# EAGLE design RoboArm (EAGLE 5.03)
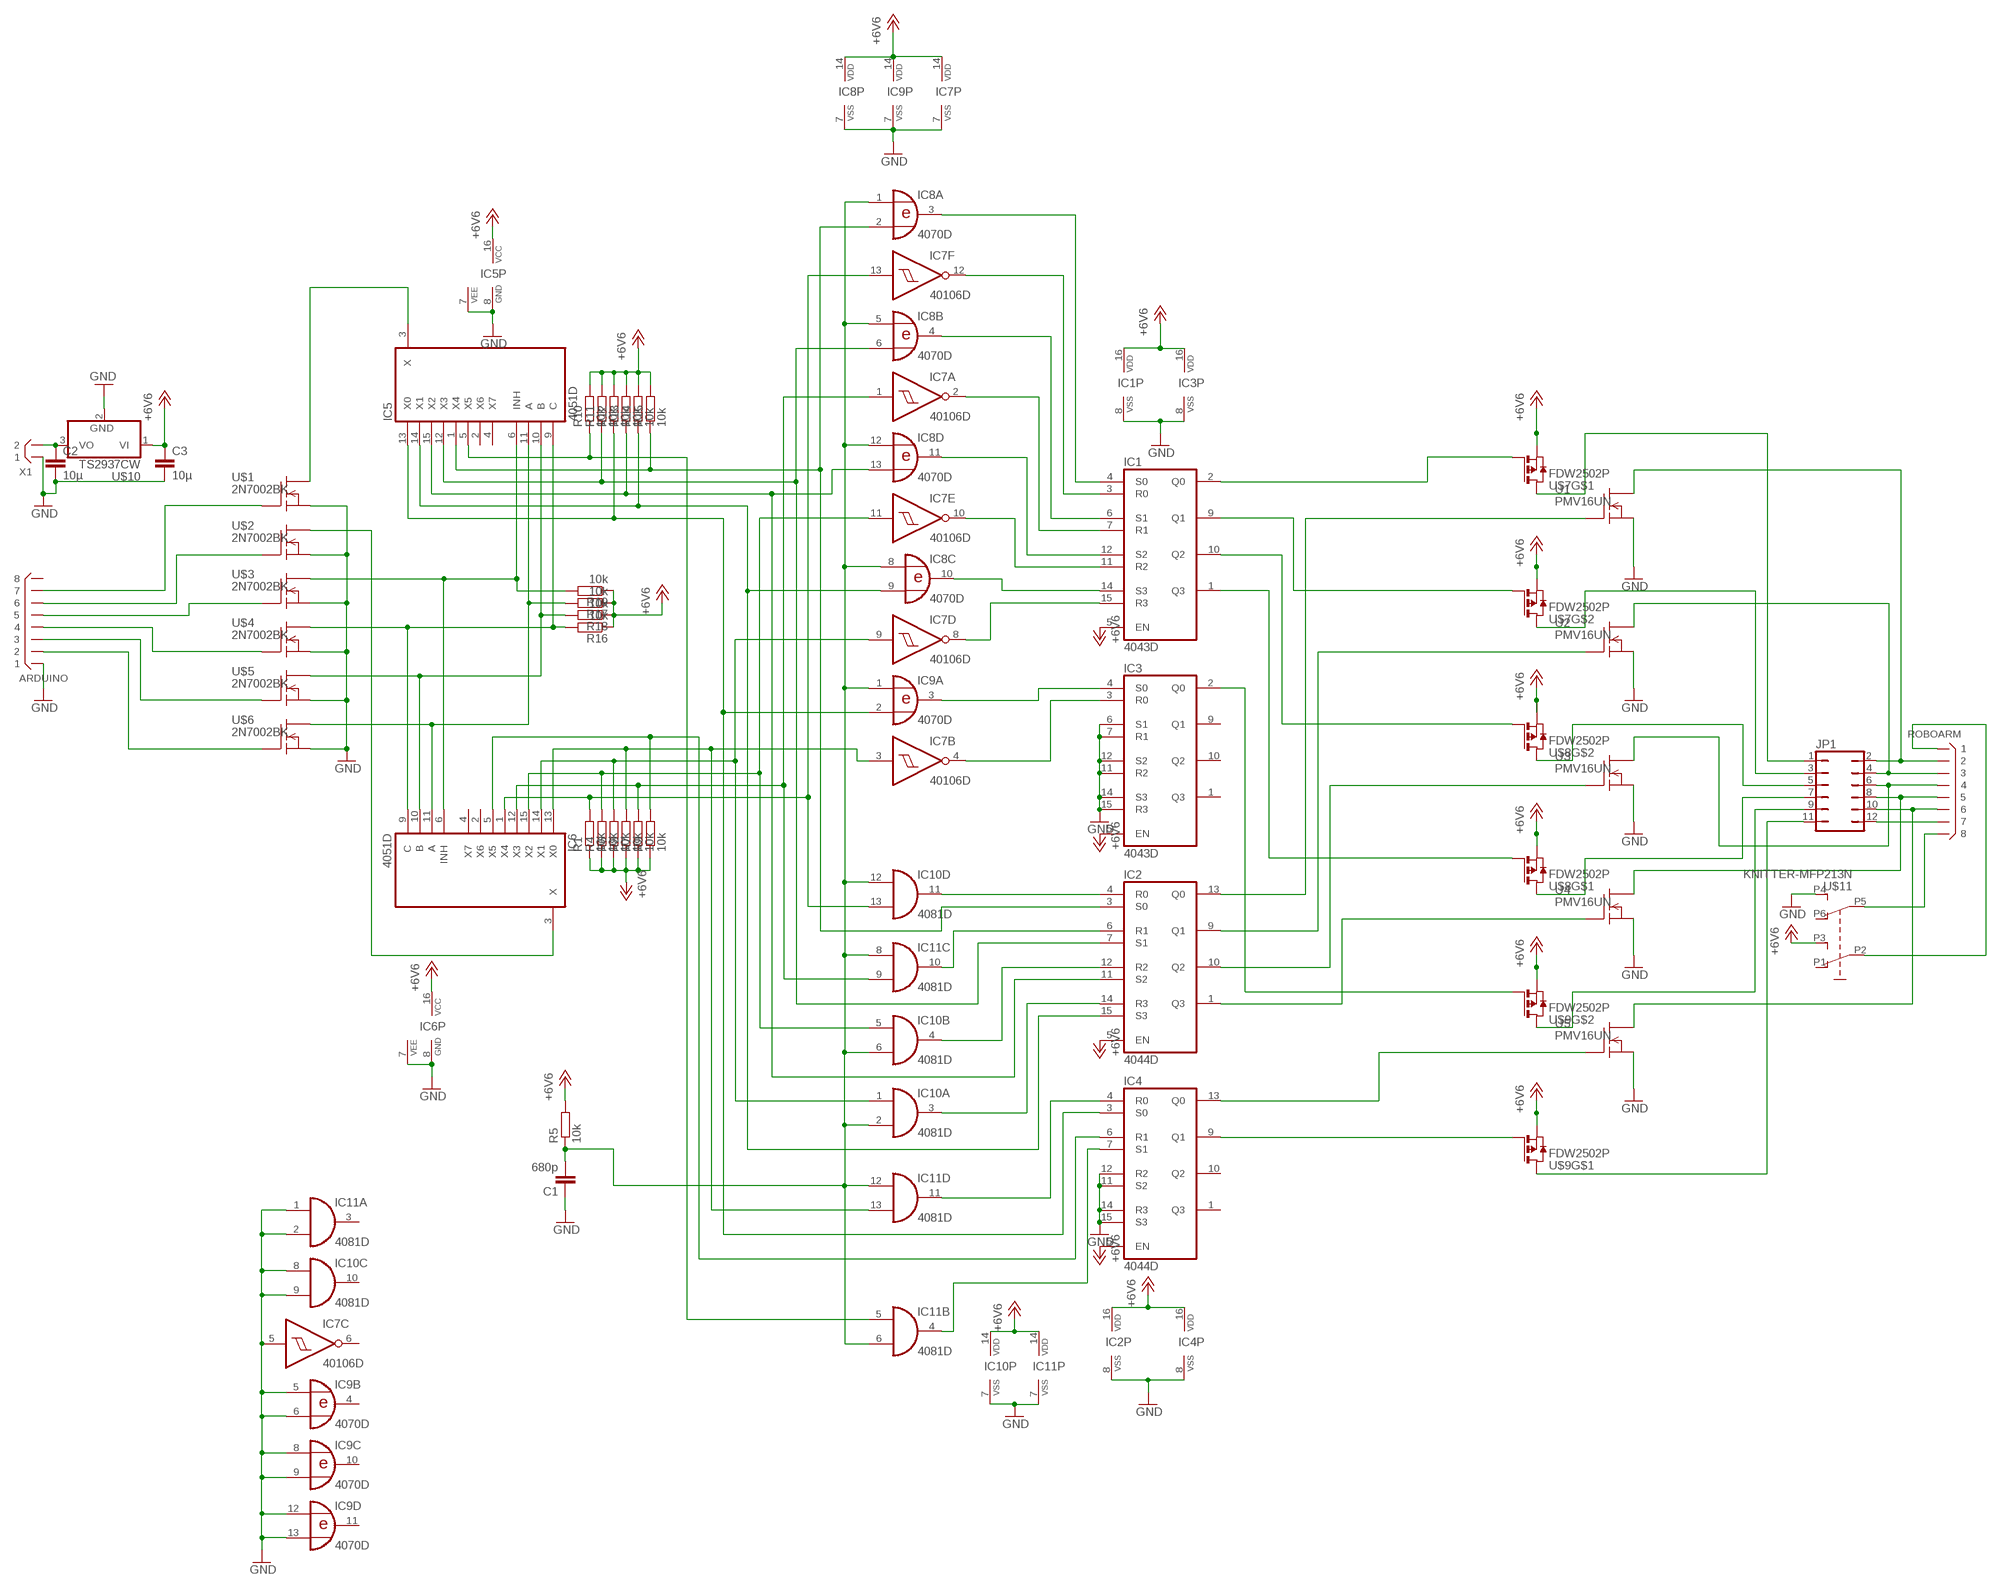
[diagram p0: schematic, sheet 1]

## Parts
ARDUINO  X08N  [X08N-SIL]
C1  680p  C5/2.5  [C5B2.5]
C2  10µ  C-EU050-024X044  [C050-024X044]
C3  10µ  C-EU050-024X044  [C050-024X044]
IC1  4043D  [SO16]
IC2  4044D  [SO16]
IC3  4043D  [SO16]
IC4  4044D  [SO16]
IC5  4051D  [SO16]
IC6  4051D  [SO16]
IC7  40106D  [SO14]
IC8  4070D  [SO14]
IC9  4070D  [SO14]
IC10  4081D  [SO14]
IC11  4081D  [SO14]
JP1  JP6Q  [JP6Q]
R1  10k  R-EU_R0805  [R0805]
R4  10k  R-EU_R0805  [R0805]
R5  10k  R-EU_R0805  [R0805]
R6  10k  R-EU_R0805  [R0805]
R7  10k  R-EU_R0805  [R0805]
R8  10k  R-EU_R0805  [R0805]
R9  10k  R-EU_R0805  [R0805]
R10  10k  R-EU_R0805  [R0805]
R11  10k  R-EU_R0805  [R0805]
R12  10k  R-EU_R0805  [R0805]
R13  10k  R-EU_R0805  [R0805]
R14  10k  R-EU_R0805  [R0805]
R15  10k  R-EU_R0805  [R0805]
R16  10k  R-EU_R0805  [R0805]
R17  10k  R-EU_R0805  [R0805]
R18  10k  R-EU_R0805  [R0805]
R19  10k  R-EU_R0805  [R0805]
ROBOARM  X08N  [X08N-SIL]
U1  PMV16UN  [SOT23]
U2  PMV16UN  [SOT23]
U3  PMV16UN  [SOT23]
U4  PMV16UN  [SOT23]
U5  PMV16UN  [SOT23]
U$1  2N7002BK  [SOT23]
U$2  2N7002BK  [SOT23]
U$3  2N7002BK  [SOT23]
U$4  2N7002BK  [SOT23]
U$5  2N7002BK  [SOT23]
U$6  2N7002BK  [SOT23]
U$7  FDW2502P  [TSSOP8]
U$8  FDW2502P  [TSSOP8]
U$9  FDW2502P  [TSSOP8]
U$10  TS2937CW  [SOT223]
U$11  KNITTER-MFP213N  [KNITTER_MFP213N]
X1  X02  [X02N-SIL]

## Nets
+5V: C2.1 U$10.3(VO) X1.2
+6V6: C3.1 IC1.5(EN) IC1.16(VDD) IC2.5(EN) IC2.16(VDD) IC3.5(EN) IC3.16(VDD) IC4.5(EN) IC4.16(VDD) IC5.16(VCC) IC6.16(VCC) IC7.14(P:VDD) IC8.14(P:VDD) IC9.14(P:VDD) IC10.14(P:VDD) IC11.14(P:VDD) R1.1 R4.1 R5.2 R6.1 R7.1 R8.1 R9.1 R10.2 R11.2 R12.2 R13.2 R14.2 R15.2 R16.1 R17.1 R18.1 R19.1 U$7.2(S) U$7.3(S2) U$7.6(S2) U$7.7(S) U$8.2(S) U$8.3(S2) U$8.6(S2) U$8.7(S) U$9.2(S) U$9.3(S2) U$9.6(S2) U$9.7(S) U$10.1(VI) U$11.P3(S)
GND: ARDUINO.1 C1.1 C2.2 C3.2 IC1.8(VSS) IC2.8(VSS) IC3.6(S1) IC3.7(R1) IC3.8(VSS) IC3.11(R2) IC3.12(S2) IC3.14(S3) IC3.15(R3) IC4.8(VSS) IC4.11(S2) IC4.12(R2) IC4.14(R3) IC4.15(S3) IC5.7(VEE) IC5.8(GND) IC6.7(VEE) IC6.8(GND) IC7.5(C:I) IC7.7(P:VSS) IC8.7(P:VSS) IC9.5(B:I0) IC9.6(B:I1) IC9.7(P:VSS) IC9.8(C:I0) IC9.9(C:I1) IC9.12(D:I0) IC9.13(D:I1) IC10.7(P:VSS) IC10.8(C:I0) IC10.9(C:I1) IC11.1(A:I0) IC11.2(A:I1) IC11.7(P:VSS) U1.2(S) U2.2(S) U3.2(S) U4.2(S) U5.2(S) U$1.2(S) U$2.2(S) U$3.2(S) U$4.2(S) U$5.2(S) U$6.2(S) U$10.2(GND) U$11.P4(S1) X1.1
N$1: ARDUINO.2 U$6.1(G)
N$2: ARDUINO.3 U$5.1(G)
N$3: ARDUINO.4 U$4.1(G)
N$4: IC1.4(S0) IC8.3(A:O)
N$5: ARDUINO.5 U$3.1(G)
N$6: ARDUINO.6 U$2.1(G)
N$7: ARDUINO.7 U$1.1(G)
N$8: IC5.6(INH) IC6.6(INH) R19.2 U$3.3(D)
N$9: IC1.3(R0) IC7.12(F:O)
N$10: IC1.6(S1) IC8.4(B:O)
N$11: IC5.9(C) IC6.9(C) R16.2 U$4.3(D)
N$12: IC5.10(B) IC6.10(B) R18.2 U$5.3(D)
N$13: IC5.11(A) IC6.11(A) R17.2 U$6.3(D)
N$14: IC1.7(R1) IC7.2(A:O)
N$15: IC1.12(S2) IC8.11(D:O)
N$16: IC1.11(R2) IC7.10(E:O)
N$17: IC1.14(S3) IC8.10(C:O)
N$18: IC1.15(R3) IC7.8(D:O)
N$19: IC3.4(S0) IC9.3(A:O)
N$20: IC3.3(R0) IC7.4(B:O)
N$21: IC2.4(R0) IC10.11(D:O)
N$22: IC2.6(R1) IC11.10(C:O)
N$23: IC2.12(R2) IC10.4(B:O)
N$24: IC2.14(R3) IC10.3(A:O)
N$25: IC4.4(R0) IC11.11(D:O)
N$26: IC2.3(S0) IC5.1(X4) IC8.2(A:I1) R15.1
N$27: IC6.1(X4) IC7.13(F:I) IC10.13(D:I1) R1.2
N$28: IC2.7(S1) IC5.12(X3) IC8.6(B:I1) R11.1
N$29: IC2.11(S2) IC5.15(X2) IC8.13(D:I1) R13.1
N$30: IC6.12(X3) IC7.1(A:I) IC11.9(C:I1) R7.2
N$31: IC6.15(X2) IC7.11(E:I) IC10.5(B:I0) R4.2
N$32: IC2.15(S3) IC5.14(X1) IC8.9(C:I1) R14.1
N$33: IC6.14(X1) IC7.9(D:I) IC10.1(A:I0) R6.2
N$34: IC4.3(S0) IC5.13(X0) IC9.2(A:I1) R12.1
N$35: IC6.13(X0) IC7.3(B:I) IC11.13(D:I1) R8.2
N$36: ROBOARM.1 U$11.P2(P)
N$37: JP1.2 ROBOARM.2 U1.3(D)
N$38: IC2.1(Q3) U4.1(G)
N$39: IC1.2(Q0) U$7.4(G)
N$40: IC1.9(Q1) U$7.5(G)
N$41: IC1.10(Q2) U$8.5(G)
N$42: IC1.1(Q3) U$8.4(G)
N$43: IC3.2(Q0) U$9.5(G)
N$44: IC2.13(Q0) U1.1(G)
N$45: IC2.9(Q1) U2.1(G)
N$46: IC2.10(Q2) U3.1(G)
N$47: JP1.4 ROBOARM.3 U2.3(D)
N$48: C1.2 IC8.1(A:I0) IC8.5(B:I0) IC8.8(C:I0) IC8.12(D:I0) IC9.1(A:I0) IC10.2(A:I1) IC10.6(B:I1) IC10.12(D:I0) IC11.6(B:I1) IC11.8(C:I0) IC11.12(D:I0) R5.1
N$49: JP1.5 U$8.8(D)
N$50: JP1.8 ROBOARM.5 U4.3(D)
N$51: JP1.9 U$9.8(D)
N$52: IC4.6(R1) IC6.5(X5) R9.2
N$53: IC4.9(Q1) U$9.4(G)
N$54: JP1.12 ROBOARM.7
N$55: IC4.7(S1) IC11.4(B:O)
N$56: IC5.5(X5) IC11.5(B:I0) R10.1
N$57: IC4.13(Q0) U5.1(G)
N$58: ROBOARM.8 U$11.P5(P1)
N$63: JP1.1 U$7.1(D)
N$64: JP1.3 U$7.8(D)
N$65: JP1.6 ROBOARM.4 U3.3(D)
N$66: JP1.7 U$8.1(D)
N$67: JP1.10 ROBOARM.6 U5.3(D)
N$68: JP1.11 U$9.1(D)
RESET: IC6.3(X) U$2.3(D)
SET: IC5.3(X) U$1.3(D)
Unconnected: ARDUINO.8 IC3.1(Q3) IC3.9(Q1) IC3.10(Q2) IC4.1(Q3) IC4.10(Q2) IC5.2(X6) IC5.4(X7) IC6.2(X6) IC6.4(X7) IC7.6(C:O) IC9.4(B:O) IC9.10(C:O) IC9.11(D:O) IC10.10(C:O) IC11.3(A:O) U$11.P1(O) U$11.P6(O1)

## Library data of the parts
ARDUINO ROBOARM = connectors:X08: Connector 8 pins
C1 = capacitor-wima:C: CAPACITOR naming: grid - package width
C2 C3 = rcl:C-EU: CAPACITOR, European symbol
IC1 IC3 = 40xx:4043: Quad 3-state NOR R/S LATCH
IC2 IC4 = 40xx:4044: Quad 3-state NAND R/S LATCH
IC5 IC6 = 40xx:4051: 8-channel ANALOG MULTIPLEXER
IC7 = 40xx:40106: Hex SCHMITT TRIGGER
IC8 IC9 = 40xx:4070: Quad 2-input XOR
IC10 IC11 = 40xx:4081: Quad 2-input AND
JP1 = jumper:JP6Q: JUMPER
R1 R4-R19 = rcl:R-EU_: RESISTOR, European symbol
U1-U5 = robo:PMV16UN: N-channel Trench MOSFET
U$1-U$6 = robo:2N7002BK: 2N7002BK N-channel Trench MOSFET
U$7-U$9 = robo:FDW2502P
U$10 = robo:TS2937CW
U$11 = robo:KNITTER-MFP213N
X1 = connectors:X02: Connector 2 pins

## Board
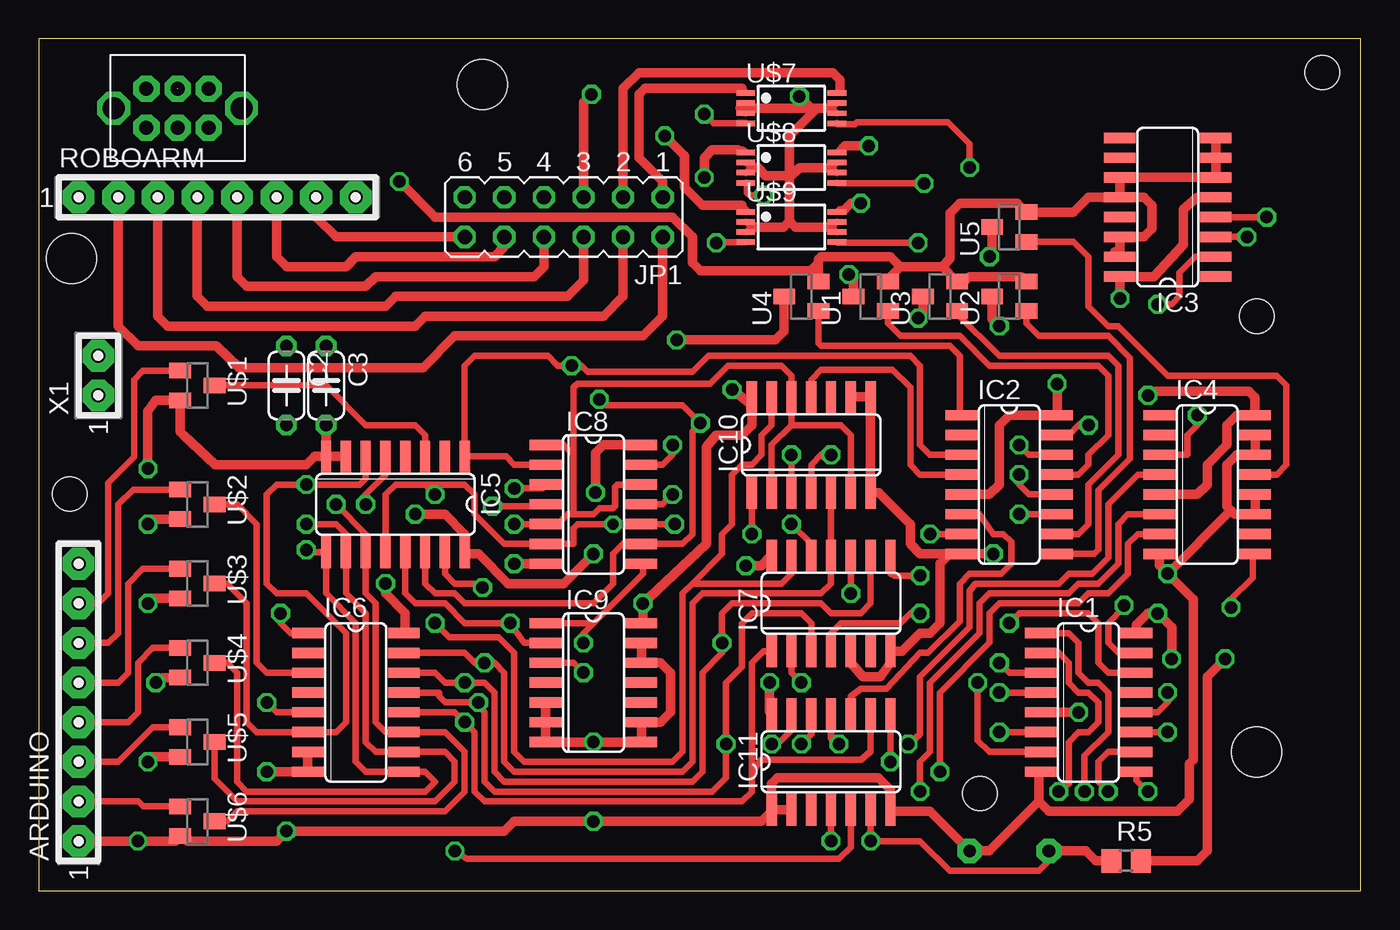
[diagram p1: board, top side]
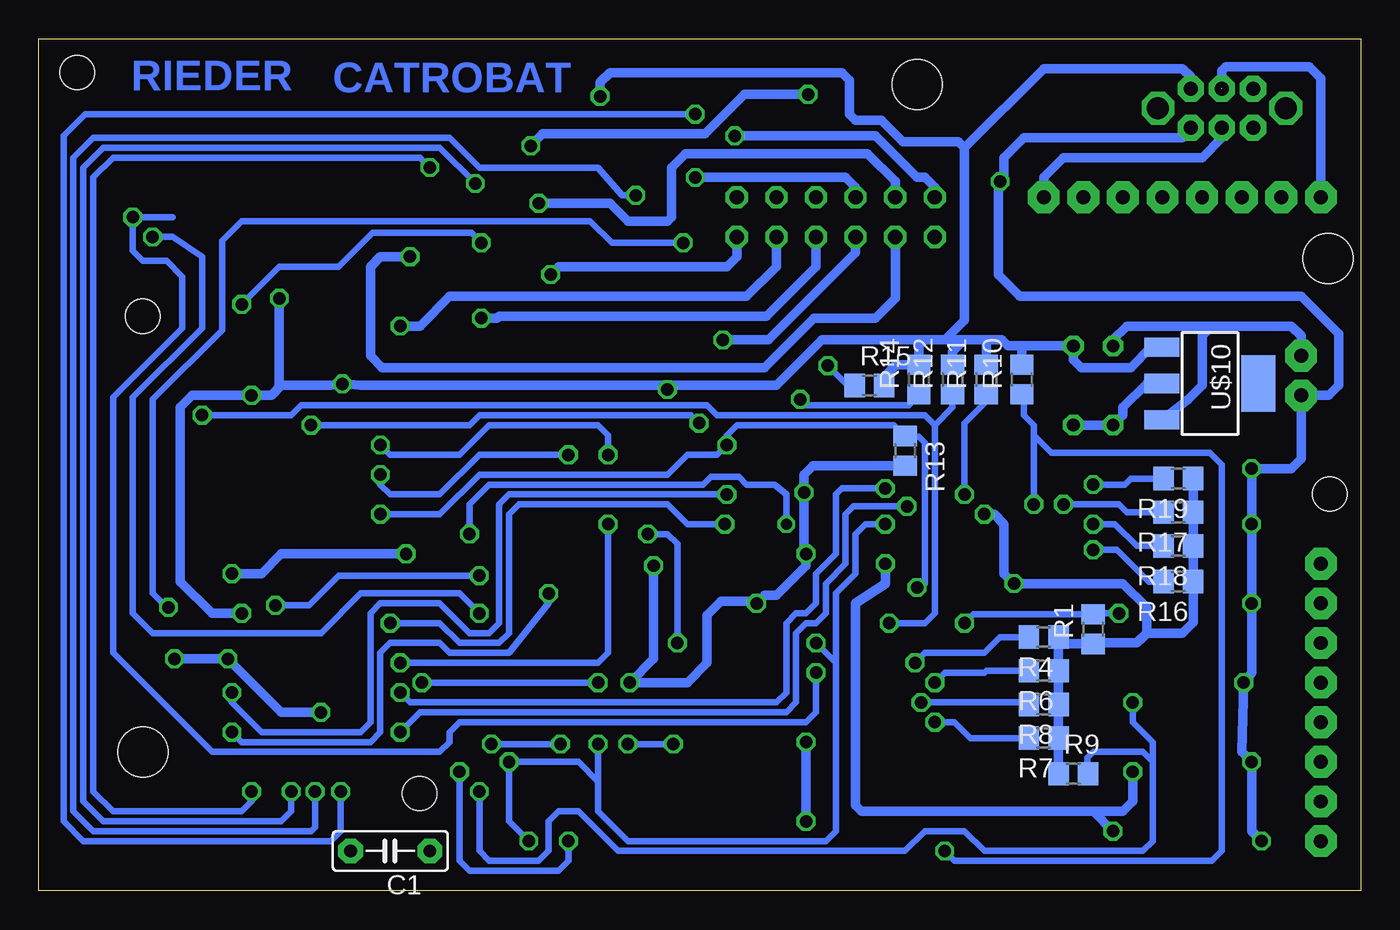
[diagram p2: board, bottom side, seen from below]

Size 84.76 x 54.6 mm. Coordinates in mm from the lower left corner, seen from the top.
Outline: 0,0 84.76,0 84.76,54.6 0,54.6 0,0
Copper layers (1*16): Top 0.035mm / dielectric 1.5mm / Bottom 0.035mm
Design rules "default *": minimum track width 10mil, minimum drill 24mil, track to track 9mil, track to pad 8mil, pad to pad 8mil, via to via 8mil, smd to smd 8mil, copper to edge 40mil, drill to drill 8mil, minimum pad ring 10mil, minimum via ring 8mil, stop-mask expansion 4mil, vias tented up to drill 0mil, thermal gap 10mil
Holes 3.2 mm at 78.11,8.89 28.45,51.69 2.08,40.51
Holes 2.2 mm at 78.11,36.83 1.98,25.43 82.3,52.45 60.35,6.22

### Footprints (pad centres in the part's own frame; a part is rotated, then mirrored left to right if it is on the bottom)
X08N-SIL = drill 0.889 pad 2.032 octagon: 1 -8.89,0; 2 -6.35,0; 3 -3.81,0; 4 -1.27,0; 5 1.27,0; 6 3.81,0; 7 6.35,0; 8 8.89,0
C5B2.5 = drill 0.813 pad 1.6 octagon: 1 -2.54,0; 2 2.54,0
C050-024X044 = drill 0.813 octagon: 1 -2.54,0; 2 2.54,0
SO16 = smd 0.66 x 2.032: 1 -4.445,-3.073; 2 -3.175,-3.073; 3 -1.905,-3.073; 4 -0.635,-3.073; 5 0.635,-3.073; 6 1.905,-3.073; 7 3.175,-3.073; 8 4.445,-3.073; 9 4.445,3.073; 10 3.175,3.073; 11 1.905,3.073; 12 0.635,3.073; 13 -0.635,3.073; 14 -1.905,3.073; 15 -3.175,3.073; 16 -4.445,3.073
SO14 = smd 0.66 x 2.032: 1 -3.81,-3.073; 2 -2.54,-3.073; 3 -1.27,-3.073; 4 0,-3.073; 5 1.27,-3.073; 6 2.54,-3.073; 7 3.81,-3.073; 8 3.81,3.073; 9 2.54,3.073; 10 1.27,3.073; 11 0,3.073; 12 -1.27,3.073; 13 -2.54,3.073; 14 -3.81,3.073
JP6Q = drill 0.914 octagon: 1 -6.35,-1.27; 2 -6.35,1.27; 3 -3.81,-1.27; 4 -3.81,1.27; 5 -1.27,-1.27; 6 -1.27,1.27; 7 1.27,-1.27; 8 1.27,1.27; 9 3.81,-1.27; 10 3.81,1.27; 11 6.35,-1.27; 12 6.35,1.27
R0805 = smd 1.3 x 1.5: 1 -0.95,0; 2 0.95,0
SOT23 = smd 1 x 1.4: 1 -0.95,-1.1; 2 0.95,-1.1; 3 0,1.1
TSSOP8 = smd 1.2 x 0.35: 1 -2.925,0.975; 2 -2.925,0.325; 3 -2.925,-0.325; 4 -2.925,-0.975; 5 2.925,-0.975; 6 2.925,-0.325; 7 2.925,0.325; 8 2.925,0.975
SOT223 = smd 1.219 x 2.235: 1 -2.311,-3.099; 2 0,-3.099; 3 2.311,-3.099 | smd 3.6 x 2.2: 4 0,3.099
KNITTER_MFP213N = drill 1.4 octagon: GND1 -4.1,0; GND2 4.1,0 | drill 0.9 pad 1.676 octagon: P1 -2,1.25; P2 0,1.25; P3 2,1.25; P4 2,-1.25; P5 0,-1.25; P6 -2,-1.25
X02N-SIL = drill 0.889 pad 2.032 octagon: 1 -1.27,0; 2 1.27,0

### Placement (x,y rotation side)
ARDUINO  2.54,12.06 90 top
C1  62.23,2.54 180 bottom
C2  15.88,32.38 270 top
C3  18.41,32.38 270 top
IC1  67.31,12.06 270 top
IC2  62.23,26.04 270 top
IC3  72.39,43.81 90 top
IC4  74.93,26.04 270 top
IC5  22.86,24.77 180 top
IC6  20.32,12.06 270 top
IC7  50.8,18.41 0 top
IC8  35.56,24.77 270 top
IC9  35.56,13.34 270 top
IC10  49.53,28.57 0 top
IC11  50.8,8.26 0 top
JP1  33.66,43.18 180 top
R1  17.14,16.76 90 bottom
R4  20.32,16.26 180 bottom
R5  69.72,1.91 0 top
R6  20.32,14.1 180 bottom
R7  20.32,9.78 180 bottom
R8  20.32,11.94 180 bottom
R9  18.41,7.49 0 bottom
R10  21.72,32.77 90 bottom
R11  24,32.77 90 bottom
R12  26.16,32.77 90 bottom
R13  29.21,28.19 270 bottom
R14  28.32,32.77 90 bottom
R15  31.5,32.38 0 bottom
R16  11.68,19.81 180 bottom
R17  11.68,24.26 180 bottom
R18  11.68,22.1 180 bottom
R19  11.68,26.42 180 bottom
ROBOARM  11.43,44.45 0 top
U1  53.34,38.1 90 top
U2  62.23,38.1 90 top
U3  57.78,38.1 90 top
U4  48.9,38.1 90 top
U5  62.23,42.55 90 top
U$1  10.16,32.38 270 top
U$2  10.16,24.77 270 top
U$3  10.16,19.68 270 top
U$4  10.16,14.61 270 top
U$5  10.16,9.53 270 top
U$6  10.16,4.45 270 top
U$7  48.26,50.16 0 top
U$8  48.26,46.35 0 top
U$9  48.26,42.55 0 top
U$10  9.65,32.51 270 bottom
U$11  8.89,50.16 0 top
X1  3.81,33.02 90 top

### Tracks (layer width: path | path; a pad name or v marks a point on that pad's centre or on a via)
+5V
  Bottom 0.61: X1.2 3.81,35.56 4.45,36.2 9.53,36.2 9.59,36.13 | U$10.3 11.07,31.47 10.16,32.38 10.16,35.56 9.59,36.13 | C2.1 15.88,35.31 14.99,36.2 9.65,36.2 9.59,36.13
+6V6  (via drill 0.8)
  Top 0.406: 50.86,50.16 U$7.7 | 50.8,50.16 50.86,50.16 | 50.86,50.16 U$7.6 | 45.66,46.35 U$8.3 | 45.85,46.35 45.66,46.35 | 50.86,46.35 U$8.7 | 50.8,46.35 50.86,46.35 | 50.86,46.35 U$8.6 | 45.66,42.55 U$9.2 | 45.72,42.55 45.66,42.55 | 45.66,42.55 U$9.3 | 50.86,42.55 U$9.6 | 50.8,42.55 50.86,42.55 | 50.86,42.55 U$9.7 | U$7.3 45.28,49.84 44.96,50.16 45.01,50.16 U$7.2 | 45.66,46.35 U$8.2
  Top 0.61: v24.13,24.13 26.04,24.13 27.3,22.86 IC5.16 27.41,21.59 28.19,21.59 30.1,19.68 33.66,19.68 v35.56,21.59 | IC6.16 23.5,16.61 23.5,17.78 22.23,19.05 v22.23,19.68 | 45.72,29.84 IC10.14 | 45.72,29.84 45.09,29.21 43.43,29.21 42.8,28.45 42.8,22.23 39.13,18.79 | IC9.14 38.73,17.25 v38.73,18.41 | v38.73,18.41 39.13,18.79 | v38.73,18.41 38.76,18.41 39.13,18.79 | v46.86,13.34 46.86,11.46 IC11.14 | v45.34,20.83 46.33,20.83 IC7.14 | 45.72,29.84 45.72,31.11 v44.45,32.13 | v65.3,32.49 IC2.16 62.23,30.48 61.59,29.84 61.59,26.04 60.96,25.4 IC2.5 | IC1.16 70.38,17.04 71.12,17.78 v71.75,17.78 72.64,16.89 v72.64,14.86 | v66.67,11.43 IC1.5 | IC4.5 74.3,25.4 74.93,26.04 74.93,27.3 76.2,28.57 76.2,29.84 76.83,30.48 IC4.16 77.98,30.5 77.98,31.62 77.6,32 71.37,32 v71.12,31.75 | v35.69,25.53 35.69,28.07 36.2,28.57 IC8.14 | v69.34,37.97 69.32,38 IC3.16 71.5,39.37 73.41,41.4 73.41,43.69 74.3,44.45 IC3.5 | 49.91,50.16 48.13,48.39 48.13,45.72 | 49.91,50.16 50.8,50.16 | 48.13,45.72 48.13,42.8 | 48.13,42.8 48.26,42.8 48.51,42.55 50.8,42.55 | 48.13,42.8 48.01,42.8 47.75,42.55 45.72,42.55 | 50.8,46.35 48.77,46.35 48.13,45.72 | 45.85,46.35 46.1,46.35 46.61,45.85 48.01,45.85 48.13,45.72 | 49.53,50.16 49.91,50.16 | 49.53,50.16 44.96,50.16 | v48.77,50.93 49.53,50.16 | R5.2 74.3,1.91 74.93,2.54 74.93,13.72 v76.07,14.86
  Bottom 0.61: v24.13,24.13 23.5,24.13 22.86,23.5 22.86,20.32 v22.23,19.68 15.24,19.68 13.72,18.16 13.72,16.64 13.59,16.51 | v45.34,20.83 45.34,14.86 v46.86,13.34 43.18,13.34 41.91,14.61 41.91,17.65 41.02,18.54 38.86,18.54 v38.73,18.41 38.23,18.92 37.47,18.92 35.56,20.83 v35.56,21.59 35.69,21.72 v35.69,25.53 35.69,26.67 35.11,27.24 R13.2 | 44.2,32.38 64.14,32.38 v65.3,32.49 66.04,32.38 69.22,32.38 | v66.67,11.43 69.22,11.43 v72.64,14.86 v76.07,14.86 | 69.22,32.38 69.85,31.75 v71.12,31.75 74.93,31.75 75.69,30.99 75.69,19.81 73.66,17.78 v71.75,17.78 | 27.94,35.31 26.67,35.31 | 26.67,35.31 25.4,35.31 | 25.4,35.31 24.13,35.31 | 24.13,35.31 22.99,35.31 22.61,34.92 21.59,34.92 | 21.59,34.92 C3.1 18.41,34.04 17.91,33.53 14.73,33.53 13.44,34.82 U$10.1 | R19.1 R17.1 R18.1 R16.1 10.73,17.21 11.43,16.51 13.59,16.51 | 14.35,15.88 13.97,16.26 | 14.35,15.88 17.08,15.88 R1.1 18.93,15.81 R4.1 R6.1 R8.1 R7.1 R9.1 | 13.59,16.51 13.72,16.51 14.35,15.88 | R10.2 21.72,34.8 21.59,34.92 | R11.2 24,35.18 24.13,35.31 | R12.2 26.16,34.54 25.4,35.31 | 27.94,35.31 28.32,34.92 R14.2 29.78,33.72 30.48,33.02 30.48,32.45 R15.2 | 69.22,32.38 69.34,32.51 v69.34,37.97 | 27.94,35.31 34.54,35.31 37.47,32.38 44.2,32.38 | v44.45,32.13 44.2,32.38 | 25.4,47.62 25.4,36.58 26.67,35.31 | v48.77,50.93 48.77,51.82 48.13,52.45 33.27,52.45 32.77,51.94 32.77,49.78 32.38,49.4 30.73,49.4 29.34,48.01 25.78,48.01 25.4,47.62 | U$11.P3 10.89,52.16 11.43,52.7 20.32,52.7 25.4,47.62
GND  (via drill 0.8)
  Top 0.61: U$5.2 7.3,8.57 v6.99,8.26 | U$4.2 7.94,13.65 v7.49,13.34 | U$3.2 7.3,18.73 v6.99,18.41 | U$2.2 7.3,23.82 v6.99,23.5 | v6.99,27.05 6.99,30.73 7.49,31.43 U$1.2 9.06,29.42 9.27,29.21 11.29,27.3 17.14,27.3 17.68,27.84 IC5.8 | IC5.8 IC5.7 | v14.61,7.62 IC6.8 IC6.7 | IC11.1 IC11.2 | 64.14,5.71 64.14,7.52 IC1.8 | IC11.1 46.99,5.08 46.35,4.45 v35.56,4.45 30.48,4.45 29.84,3.81 v15.88,3.81 15.24,3.17 9.53,3.17 9.21,3.5 U$6.2 8.74,3.17 v6.35,3.17 ARDUINO.1 | IC9.5 IC9.6 IC9.7 v35.56,9.53 IC9.8 IC9.9 39.88,10.79 40.51,11.43 40.51,13.97 39.88,14.61 IC9.12 IC9.13 | v30.48,20.95 IC8.7 | 64.14,5.71 64.77,5.08 73.03,5.08 73.79,5.84 73.79,8.13 74.04,8.38 74.04,18.67 v72.39,20.32 | IC10.9 IC10.8 IC10.7 53.87,25.5 55.88,23.5 55.88,22.23 56.52,21.59 58.42,21.59 | 58.42,21.59 57.78,20.95 57.78,17.14 57.15,16.51 56.52,16.51 55.35,15.34 IC7.7 54.61,14.61 53.98,13.72 52.83,13.72 52.07,14.61 IC7.5 | v61.21,21.59 IC2.8 58.42,21.59 | IC3.8 IC3.7 IC3.6 IC3.11 IC3.12 | IC4.12 IC4.11 76.71,24.13 76.45,24.38 | IC4.15 IC4.14 76.83,27.94 76.2,27.3 76.2,24.64 76.45,24.38 | IC11.1 46.99,6.86 47.37,7.24 53.85,7.24 54.61,6.48 IC11.7 54.71,5.08 57.15,5.08 C1.1 60.96,2.54 64.14,5.71 | IC4.8 71.86,20.85 v72.39,20.32 | v72.39,20.32 76.45,24.38 | IC5.8 C3.2 | IC3.12 70.87,44.45 71.37,43.94 71.37,42.42 70.87,41.91 IC3.14 IC3.15 69,40.95 | U1.2 54.44,39.2 55.24,40.01 | 55.24,40.01 57.93,40.01 | 57.93,40.01 U3.2 59.37,39.05 59.69,39.37 63.01,39.37 U2.2 | 49.99,40.26 U4.2 | 49.99,40.26 49.99,40.47 50.16,40.64 54.61,40.64 55.24,40.01 | 57.93,40.01 58.42,40.49 58.42,43.43 59.05,44.07 62.76,44.07 U5.2 66.36,43.49 67.31,44.45 IC3.12
  Top 0.61: 49.99,40.26 49.49,39.75 42.42,39.75 41.91,40.26 41.91,41.91 40.64,43.18 25.4,43.18 v23.11,45.47
  Bottom 0.61: v6.35,3.17 6.99,3.81 v6.99,8.26 7.62,8.89 v7.49,13.34 6.99,13.97 v6.99,18.41 v6.99,23.5 v6.99,27.05 4.45,27.05 3.81,27.69 X1.1 2.03,31.75 1.4,32.38 1.4,35.69 3.81,38.1 21.84,38.1 23.24,39.5 23.24,45.34 v23.11,45.47 22.86,45.72 22.86,46.99 21.59,48.26 11.43,48.26 10.89,48.8 U$11.P4 | v30.48,20.95 30.48,19.68 32.38,18.41 32.38,5.46 32,5.08 17.14,5.08 | 17.14,5.08 15.24,5.08 14.61,5.71 v14.61,7.62 | v15.88,3.81 17.14,5.08 | v35.56,4.45 v35.56,9.53 | v61.21,21.59 69.22,21.59 70.48,20.32 v72.39,20.32 | U$10.2 13.72,32.51 15.24,30.99 15.24,30.48 C2.2 C3.2
N$1
  Top 0.406: U$6.1 6.67,5.39 6.35,5.71 ARDUINO.2
N$2
  Top 0.406: U$5.1 7.3,10.47 5.08,8.26 ARDUINO.3
N$3
  Top 0.406: U$4.1 7.3,15.55 6.35,14.61 6.35,11.43 5.71,10.79 ARDUINO.4
N$4  (via drill 0.8)
  Top 0.406: v30.48,25.78 32.26,25.78 32.38,25.91 IC8.3 | v61.59,12.7 IC1.4
  Bottom 0.406: v30.48,25.78 33.27,25.78 33.66,25.4 33.66,21.59 34.92,20.32 34.92,18.41 35.56,17.78 36.2,17.78 36.83,17.14 36.83,12.7 37.47,12.06 60.96,12.06 v61.59,12.7
N$5
  Top 0.406: U$3.1 6.67,20.64 5.71,19.68 5.71,13.97 5.08,13.34 ARDUINO.5
N$6
  Top 0.406: U$2.1 6.03,25.71 5.08,24.77 5.08,16.51 4.45,15.88 ARDUINO.6
N$7
  Top 0.406: ARDUINO.7 3.81,18.41 4.45,19.05 4.45,26.16 6.1,27.81 6.1,32.77 6.67,33.34 U$1.1
N$8  (via drill 0.8)
  Top 0.406: U$3.3 12.06,19.68 13.34,18.41 13.34,10.79 13.97,10.16 IC6.6 19.05,10.16 19.68,10.79 19.68,16.51 17.14,19.05 15.24,19.05 14.61,19.68 14.61,25.4 15.24,26.04 v17.14,26.04 20.57,26.04 20.95,26.42 IC5.6
  Bottom 0.406: v17.14,26.04 15.11,26.04 14.73,26.42 R19.2
N$9  (via drill 0.8)
  Top 0.406: IC7.12 49.53,22.23 v48.26,23.5 | v61.59,14.61 62.23,13.97 IC1.3
  Bottom 0.406: v48.26,23.5 48.26,15.24 48.9,14.61 v61.59,14.61
N$10  (via drill 0.8)
  Top 0.406: v29.08,24.64 32.13,24.64 IC8.4 | v61.59,10.16 IC1.6
  Bottom 0.406: v29.08,24.64 32.51,24.64 33.02,24.13 33.02,20.95 34.29,19.68 34.29,17.78 34.92,17.14 35.56,17.14 36.2,16.51 36.2,12.06 36.83,11.43 60.33,11.43 v61.59,10.16
N$11  (via drill 0.8)
  Top 0.406: U$4.3 12.06,14.61 12.7,13.97 12.7,6.99 13.34,6.35 24.77,6.35 25.4,6.99 24.77,7.62 IC6.9 20.95,7.62 20.32,8.26 20.32,17.14 18.41,19.05 IC5.9 17.37,21.69 v17.14,21.84
  Bottom 0.406: R16.2 13.59,19.81 15.62,21.84 v17.14,21.84
N$12  (via drill 0.8)
  Top 0.406: U$5.3 11.26,7.16 12.7,5.71 25.4,5.71 26.67,6.99 26.67,8.26 26.04,8.89 IC6.10 21.59,8.89 20.95,9.53 20.95,17.78 19.68,19.05 IC5.10 19.68,22.86 19.05,23.5 v17.14,23.5
  Bottom 0.406: R18.2 14.35,22.1 15.75,23.5 v17.14,23.5
N$13  (via drill 0.8)
  Top 0.406: U$6.3 12.06,4.45 12.7,5.08 26.04,5.08 27.3,6.35 27.3,8.89 26.04,10.16 IC6.11 22.23,10.16 21.59,10.79 21.59,18.41 20.95,19.05 IC5.11 20.95,22.86 v19.05,24.77
  Bottom 0.406: v19.05,24.77 15.49,24.77 14.99,24.26 R17.2
N$14  (via drill 0.8)
  Top 0.406: IC7.2 48.26,13.97 v48.9,13.34 | v60.2,13.34 60.2,9.65 60.96,8.89 IC1.7
  Bottom 0.406: v48.9,13.34 v60.2,13.34
N$15  (via drill 0.8)
  Top 0.406: v72.39,12.7 72.39,12.06 71.75,11.43 IC1.12 | IC8.11 40.01,24.77 v40.64,25.4
  Bottom 0.406: v40.64,25.4 54.61,25.4 55.24,24.77 55.24,17.14 55.88,16.51 57.15,16.51 59.05,18.41 62.87,18.41 63.5,17.78 63.5,10.79 64.14,10.16 70.48,10.16 72.39,12.06 v72.39,12.7
N$16  (via drill 0.8)
  Top 0.406: v52.07,19.05 IC7.10 | v72.39,10.16 IC1.11
  Bottom 0.406: v52.07,19.05 52.07,18.41 54.61,15.24 58.42,15.24 59.05,15.88 62.23,15.88 62.87,15.24 62.87,10.16 63.5,9.53 71.75,9.53 v72.39,10.16
N$17  (via drill 0.8)
  Top 0.406: IC1.14 68.58,13.97 67.94,14.61 67.94,17.14 67.31,17.78 62.87,17.78 v62.23,17.14 | IC8.10 v40.77,23.5
  Bottom 0.406: v40.77,23.5 43.18,23.5 44.45,24.77 53.98,24.77 54.61,24.13 54.61,16.51 55.24,15.88 57.78,15.88 59.05,17.14 v62.23,17.14
N$18  (via drill 0.8)
  Top 0.406: IC1.15 69.22,15.24 68.58,15.88 68.58,17.14 69.6,18.16 v69.6,18.29 | IC7.8 54.61,20.32 54.86,20.19 v56.52,20.19
  Bottom 0.406: v56.52,20.19 65.53,20.19 67.44,18.29 v69.6,18.29
N$19  (via drill 0.8)
  Top 0.406: IC9.3 34.29,14.61 v34.92,13.97 | v78.74,43.18 IC3.4
  Bottom 0.406: v34.92,13.97 34.92,11.43 35.56,10.79 57.78,10.79 58.42,10.16 58.42,9.53 59.05,8.89 73.66,8.89 80.01,15.24 80.01,31.62 75.56,36.07 75.56,39.37 76.58,40.39 78.11,40.39 78.74,41.02 v78.74,43.18 76.2,43.18
N$20  (via drill 0.8)
  Top 0.406: IC7.4 50.8,16.51 51.44,17.14 55.24,17.14 55.88,17.78 v56.52,17.78 | v77.47,41.91 IC3.3
  Bottom 0.406: v56.52,17.78 57.78,19.05 64.14,19.05 66.67,16.51 72.39,16.51 | 72.39,16.51 73.03,16.51 | 72.39,16.51 77.47,16.51 78.74,17.78 78.74,31.62 74.3,36.07 74.3,40.64 76.2,41.91 v77.47,41.91
N$21
  Top 0.406: IC2.4 56.52,26.67 55.88,27.3 55.88,32.26 54.74,33.4 50.16,33.4 49.53,32.77 IC10.11
N$22
  Top 0.406: IC11.10 52.07,12.45 52.7,12.95 54.36,12.95 56.52,15.24 57.02,15.24 59.05,17.27 59.05,19.68 59.69,20.32 61.72,20.32 62.36,20.95 62.36,22.35 61.85,22.86 61.21,22.86 60.33,24.13 IC2.6
N$23  (via drill 0.8)
  Top 0.406: v62.87,26.67 62.87,26.04 63.5,25.4 IC2.12 | IC10.4 49.53,27.3 50.16,27.94 v50.8,27.94
  Bottom 0.406: v50.8,27.94 56.52,27.94 59.05,25.4 62.23,25.4 62.87,26.04 v62.87,26.67
N$24  (via drill 0.8)
  Top 0.406: v62.87,28.57 63.5,27.94 IC2.14 | IC10.3 v48.26,27.94
  Bottom 0.406: v62.87,28.57 62.23,27.94 57.78,27.94 55.88,29.84 48.9,29.84 48.26,29.21 v48.26,27.94
N$25  (via drill 0.8)
  Top 0.406: IC11.11 50.8,9.78 v51.31,9.4 | v55.75,9.4 56.52,10.03 56.52,13.72 59.69,16.89 59.69,19.18 60.07,19.68 65.41,19.68 66.04,20.32 67.56,20.32 68.58,21.34 68.58,24.77 70.48,26.67 IC4.4
  Bottom 0.406: v51.31,9.4 v55.75,9.4
N$26  (via drill 0.8)
  Top 0.406: IC2.3 57.15,27.94 56.52,28.57 56.52,33.66 55.88,34.29 42.93,34.29 41.91,33.27 35.18,33.27 34.8,33.66 v34.16,33.66 33.27,33.66 32.64,34.29 27.94,34.29 27.3,33.66 IC5.1 29.95,27.84 30.48,27.3 IC8.2
  Bottom 0.406: R15.1 32.89,32.38 v34.16,33.66
N$27  (via drill 0.8)
  Top 0.406: IC6.1 16.13,16.51 15.49,17.14 v15.49,17.78 | IC10.13 46.99,29.84 46.35,29.21 46.35,27.94 45.72,27.3 45.09,27.3 44.45,26.67 44.45,23.5 43.81,22.86 43.81,21.59 41.91,19.68 | IC7.13 48.26,20.32 47.62,19.68 41.91,19.68 | 41.91,19.68 41.27,19.05 41.27,8.89 40.64,8.26 31.11,8.26 30.48,8.89 30.48,15.24 29.46,16.26 26.29,16.26 v25.4,17.14
  Bottom 0.406: 17.08,17.78 v15.49,17.78 | R1.2 24.83,17.71 v25.4,17.14
  Bottom 0.61: R1.2 17.08,17.78
N$28  (via drill 0.7, 0.8)
  Top 0.406: v57.15,22.86 IC2.7 | IC5.12 22.23,25.4 22.86,26.04 24.77,26.04 | v36.83,23.5 34.54,23.5 34.29,23.24 34.29,22.23 IC8.6 29.84,22.23 27.94,24.13 27.94,25.4 27.3,26.04 24.77,26.04 | 24.77,26.04 v25.4,25.4
  Bottom 0.406: v57.15,22.86 57.15,24.77 55.88,26.04 42.16,26.04 41.66,26.54 39.88,26.54 39.37,26.04 37.59,26.04 36.83,25.4 v36.83,23.5 | R11.1 24,31.37 25.4,29.97 v25.4,25.4
N$29  (via drill 0.8)
  Top 0.406: IC5.15 26.04,20.32 26.67,19.68 28.19,19.68 v28.45,19.43 | v62.87,24.13 IC2.11 | v40.64,28.57 40.64,27.94 40.01,27.3 IC8.13
  Bottom 0.406: v62.87,24.13 59.05,24.13 56.52,26.67 44.45,26.67 43.18,27.94 41.27,27.94 v40.64,28.57 40.64,29.21 40.01,29.84 29.91,29.84 R13.1 | v28.45,19.43 27.94,19.68 27.94,28.7 28.32,29.08 29.15,29.08 R13.1 | R13.1 29.14,29.14
N$30  (via drill 0.8 pad 0.81)
  Top 0.406: IC6.12 26.67,11.43 v27.3,10.79 27.94,10.16 27.94,6.35 28.57,5.71 45.09,5.71 45.72,6.35 45.72,7.62 | IC7.1 46.46,15.34 45.72,14.61 45.72,7.62 | IC11.9 53.34,8.89 52.7,8.38 46.35,8.38 45.72,7.62
  Bottom 0.406: R7.2 25.02,9.78 26.04,10.79 v27.3,10.79
N$31  (via drill 0.8 pad 0.81)
  Top 0.406: IC6.15 27.3,15.24 27.94,14.61 v28.57,14.61 29.21,14.61 29.84,13.97 29.84,8.26 30.48,7.62 41.27,7.62 41.91,8.26 41.91,18.41 42.55,19.05 50.16,19.05 50.8,19.68 IC7.11 IC10.5
  Bottom 0.406: R4.2 23.11,16.26 24.13,15.24 27.94,15.24 v28.57,14.61
N$32  (via drill 0.8)
  Top 0.406: IC5.14 24.77,19.68 25.4,19.05 26.67,19.05 27.3,18.41 35.56,18.41 36.83,19.68 36.83,21.59 37.47,22.23 IC8.9 41.27,22.23 41.91,22.86 41.91,29.46 v42.42,29.97 41.27,31.11 36.32,31.11 v35.94,31.5 | v67.31,29.84 66.67,29.84 66.04,29.21 IC2.15
  Bottom 0.406: v42.42,29.97 42.93,30.48 56.52,30.48 57.15,29.84 v67.31,29.84 | R14.1 28.32,31.75 28.96,31.11 35.56,31.11 v35.94,31.5
N$33  (via drill 0.8, 0.8 pad 0.81)
  Top 0.406: IC7.9 53.34,18.41 52.7,17.78 50.8,17.78 50.16,18.41 44.45,18.41 43.81,17.78 v43.81,15.88 43.81,15.24 42.55,13.97 42.55,7.62 41.91,6.99 29.84,6.99 29.21,7.62 29.21,12.7 28.57,13.34 v27.3,13.34 26.04,13.34 25.4,13.97 IC6.14 | v45.72,22.86 IC10.1
  Bottom 0.406: v45.72,22.86 44.45,22.86 43.81,22.23 v43.81,15.88 | R6.2 24,14.1 24.13,13.97 26.67,13.97 v27.3,13.34
N$34  (via drill 0.8)
  Top 0.406: IC5.13 23.5,19.05 24.13,18.41 26.04,18.41 27.3,17.14 v30.23,17.14 31.11,15.88 IC9.2 31.75,15.88 | v74.3,30.48 74.3,29.84 73.66,29.21 73.66,27.94 IC4.3
  Bottom 0.406: v30.23,17.14 29.21,17.14 | 29.21,17.14 28.57,17.14 | v74.3,30.48 68.58,30.48 67.94,31.11 41.91,31.11 41.27,30.48 27.94,30.48 27.3,29.84 | 27.3,29.84 27.3,17.78 27.94,17.14 29.21,17.14 | R12.1 26.16,30.99 27.3,29.84
N$35  (via drill 0.8, 0.8 pad 0.81)
  Top 0.406: IC7.3 49.53,17.14 48.9,17.78 45.72,17.78 45.09,17.14 45.09,14.35 44.07,13.34 v44.07,9.4 44.07,7.24 43.18,6.35 29.21,6.35 28.57,6.99 28.57,11.43 28.19,11.81 v28.19,12.06 26.04,12.06 25.65,12.45 25.65,12.7 IC6.13 | v46.99,9.4 47.37,9.4 48.26,10.29 IC11.13
  Bottom 0.406: v44.07,9.4 v46.99,9.4 | R8.2 21.59,12.06 v28.19,12.06
N$36  (1 unrouted)
  Bottom 0.61: U$11.P2 8.89,52.58 8.64,52.83 3.3,52.83 2.54,52.07 ROBOARM.1
N$37  (via drill 0.8)
  Top 0.61: U1.3 52.24,39.2 v51.94,39.5 | JP1.2 40.01,36.83 38.73,35.56 26.67,35.56 24.64,33.53 12.83,33.53 11.4,34.9 11.38,34.92 6.35,34.92 5.08,36.2 ROBOARM.2
  Bottom 0.61: v51.94,39.5 51.44,40.01 40.64,40.01 40.01,40.64 JP1.2
N$38
  Top 0.406: 59.18,30.5 IC2.1 59.05,30.58 59.05,34.29 58.42,34.92 50.16,34.92 49.99,35.09 U4.1
N$39  (via drill 0.8)
  Top 0.406: IC1.2 65.41,15.24 66.04,14.61 66.04,13.34 66.67,12.7 67.31,12.7 67.94,12.06 67.94,10.79 67.31,10.16 66.67,10.16 66.04,9.53 66.04,6.86 65.91,6.86 v65.41,6.35 | U$7.4 43.27,49.19 v42.67,49.78
  Bottom 0.406: v65.41,6.35 65.41,3.81 66.04,3.17 81.92,3.17 83.19,4.45 83.19,48.39 81.79,49.78 v42.67,49.78
N$40  (via drill 0.8)
  Top 0.406: IC1.9 70.38,7.09 v71.12,6.35 | v59.69,46.35 59.69,47.88 58.29,49.28 52.45,49.28 52.32,49.15 51.23,49.15 U$7.5
  Bottom 0.406: v71.12,6.35 71.12,5.71 71.75,5.08 80.01,5.08 81.28,6.35 81.28,45.72 80.01,46.99 60.33,46.99 v59.69,46.35
N$41  (via drill 0.8)
  Top 0.406: IC1.10 68.58,8.89 67.94,8.26 67.94,6.99 v68.58,6.35 | v56.77,45.34 51.23,45.34 U$8.5
  Bottom 0.406: v68.58,6.35 68.58,5.08 69.22,4.45 80.64,4.45 81.92,5.71 81.92,46.35 80.64,47.62 59.05,47.62 v56.77,45.34
N$42  (via drill 0.8)
  Top 0.406: IC1.1 66.04,16.51 66.67,15.88 66.67,13.97 67.31,13.34 67.94,13.34 68.58,12.7 68.58,10.16 67.06,8.64 v67.06,6.35 | U$8.4 45.42,45.38 45.42,44.74 45.59,44.58 v46.48,44.58
  Bottom 0.406: v67.06,6.35 67.06,4.06 67.31,3.81 81.28,3.81 82.55,5.08 82.55,46.99 81.28,48.26 58.42,48.26 56.52,46.35 48.9,46.35 47.37,44.58 v46.48,44.58
N$43  (via drill 0.8)
  Top 0.406: v56.39,41.53 51.23,41.53 U$9.5 | v71.75,37.59 72.64,37.59 73.15,38.1 73.15,39.62 74.17,40.64 IC3.2
  Bottom 0.406: v56.39,41.53 57.02,42.16 63.37,42.16 65.53,40.01 69.34,40.01 v71.75,37.59
N$44
  Top 0.406: IC2.13 66.67,26.67 67.31,27.3 67.31,27.94 68.58,29.21 68.58,33.02 67.94,33.66 60.96,33.66 59.05,35.56 55.24,35.56 54.44,36.37 U1.1
N$45
  Top 0.406: IC2.9 67.69,21.59 67.94,21.84 67.94,25.65 69.98,27.69 69.98,33.15 69.98,34.16 68.58,35.56 64.14,35.56 63.33,36.37 U2.1
N$46
  Top 0.406: IC2.10 66.67,22.86 67.31,23.5 67.31,26.04 69.22,27.94 69.22,33.66 68.58,34.29 61.59,34.29 58.88,37 U3.1
N$47  (via drill 0.8)
  Top 0.61: U2.3 61.13,36.66 v61.59,36.2 | ROBOARM.3 7.62,36.83 8.26,36.2 24.13,36.2 24.77,36.83 36.2,36.83 37.47,38.1 JP1.4
  Bottom 0.61: v61.59,36.2 60.33,36.2 58.42,38.1 39.37,38.1 37.47,40.01 JP1.4
N$48  (via drill 0.8)
  Top 0.406: 34.29,24.13 34.29,27.94 | 34.29,27.94 33.66,28.57 IC8.1 | 35.56,17.14 IC9.1 | 35.56,17.14 38.73,20.32 38.73,20.85 IC8.8 | v30.48,23.5 IC8.5 33.27,23.5 33.91,24.13 34.29,24.13 | 39.37,26.04 IC8.12 37.08,26.04 36.96,25.91 36.96,24.64 36.83,24.51 35.94,24.51 35.56,24.13 34.29,24.13 | v34.92,15.88 34.92,16.51 35.56,17.14 | IC10.2 46.99,28.57 48.26,29.84 | 48.26,29.84 IC10.12 48.26,33.02 47.62,33.66 44.2,33.66 43.05,32.51 34.54,32.51 34.29,32.26 34.29,27.94 | IC10.6 52.07,29.21 51.44,29.84 48.26,29.84 | v54.61,8.26 IC11.8 | IC11.12 49.53,10.03 v48.9,9.4 | IC11.6 v53.34,3.17 56.52,3.17 58.42,1.27 64.14,1.27 64.77,1.91 C1.2
  Top 0.61: C1.2 67.16,2.54 67.79,1.91 R5.1
  Bottom 0.406: 33.66,14.61 33.66,3.81 34.29,3.17 46.99,3.17 48.9,5.08 | 33.66,14.61 33.66,19.05 32.38,20.32 32.38,22.86 31.75,23.5 v30.48,23.5 | 33.66,14.61 v34.92,15.88 | 48.9,5.08 v48.9,9.4 | 48.9,5.08 48.9,6.99 50.16,8.26 v54.61,8.26 54.61,4.45 v53.34,3.17
N$49  (via drill 0.8)
  Top 0.406: 51.56,47.62 51.48,47.62 U$8.8
  Top 0.61: JP1.5 34.92,50.55 v35.43,51.05 | v53.21,47.75 51.69,47.75 51.56,47.62
  Bottom 0.61: v35.43,51.05 39.5,51.05 42.04,48.51 52.45,48.51 v53.21,47.75
N$50  (via drill 0.8)
  Top 0.61: U4.3 47.8,35.86 47.24,35.31 v40.89,35.31 | ROBOARM.5 12.7,39.37 13.34,38.73 20.95,38.73 21.59,39.37 31.75,39.37 32.38,40.01 JP1.8
  Bottom 0.61: v40.89,35.31 37.97,35.31 32.38,40.89 JP1.8
N$51  (via drill 0.8)
  Top 0.406: 51.69,43.69 51.35,43.69 U$9.8
  Top 0.61: v52.7,44.07 52.07,44.07 51.69,43.69
  Bottom 0.61: v52.7,44.07 48.13,44.07 46.99,42.93 44.45,42.93 44.2,43.18 44.2,46.35 43.31,47.24 31.62,47.24 29.84,45.47 JP1.9
N$52  (via drill 0.8)
  Top 0.406: IC6.5 15.24,11.43 v14.61,12.06 | v56.52,6.35 56.52,8.26 57.15,8.89 57.15,13.34 60.33,16.51 60.33,18.41 60.96,19.05 66.04,19.05 66.67,19.68 67.94,19.68 69.22,20.95 69.22,23.5 69.85,24.13 IC4.6
  Bottom 0.406: v14.61,12.06 14.61,10.79 13.34,9.53 13.34,8.26 | 13.34,8.26 13.34,3.17 13.97,2.54 24.13,2.54 25.4,3.81 27.94,3.81 29.21,2.54 47.62,2.54 50.16,5.08 51.44,5.08 52.07,4.45 52.07,2.54 52.7,1.91 55.88,1.91 56.52,2.54 v56.52,6.35 | 13.34,8.26 13.97,8.89 17.14,8.89 17.53,8.51 17.53,7.55 R9.2
N$53  (via drill 0.8)
  Top 0.406: U$9.4 43.48,41.57 v43.43,41.53 | v76.45,18.16 76.45,18.67 77.85,20.07 77.85,21.44 IC4.9
  Bottom 0.406: v43.43,41.53 48.01,41.53 49.4,42.93 71.75,42.93 73.03,41.66 73.03,35.94 77.47,31.5 77.47,19.05 76.58,18.16 v76.45,18.16
N$54
  Top 0.61: JP1.12 19.05,41.91 17.78,43.18 ROBOARM.7
N$55  (via drill 0.8)
  Top 0.406: v50.8,3.17 IC11.4 | v57.78,7.62 57.78,12.7 60.96,15.88 60.96,17.78 61.59,18.41 66.67,18.41 67.31,19.05 68.58,19.05 69.85,20.32 69.85,22.23 70.48,22.86 IC4.7
  Bottom 0.406: v50.8,3.17 50.8,1.91 51.44,1.27 57.15,1.27 57.78,1.91 v57.78,7.62
N$56  (via drill 0.8)
  Top 0.406: IC5.5 22.23,26.67 20.95,25.4 v20.95,24.77 | IC11.5 52.07,2.79 51.31,2.03 27.43,2.03 v26.67,2.54
  Bottom 0.406: v26.67,2.54 26.04,1.91 9.53,1.91 8.89,2.54 8.89,27.3 9.65,28.07 19.81,28.07 20.95,29.21 | 20.95,29.21 v20.95,24.77 | 20.95,29.21 20.95,29.84 21.59,30.48 21.59,31.69 R10.1
N$57
  Top 0.406: IC4.13 79.38,26.67 80.01,27.3 80.01,32.38 79.38,33.02 72.39,33.02 69.22,36.2 68.58,36.2 67.31,37.47 67.31,40.64 66.36,41.59 U5.1
N$58
  Bottom 0.61: U$11.P5 8.89,48.26 10.16,46.99 19.05,46.99 20.32,45.72 ROBOARM.8
N$63
  Top 0.406: 45.04,51.44 U$7.1 45.09,51.39 45.09,51.44
  Top 0.61: 45.09,51.44 38.86,51.44 38.48,51.05 38.48,46.99 40.01,45.47 JP1.1
N$64
  Top 0.406: 51.38,51.34 U$7.8
  Top 0.61: 51.38,51.34 51.38,51.99 50.93,52.45 38.48,52.45 37.47,51.44 JP1.3
N$65  (via drill 0.8)
  Top 0.61: U3.3 56.69,37 v56.39,36.7 | ROBOARM.4 10.16,38.1 10.79,37.47 22.23,37.47 22.86,38.1 33.91,38.1 34.92,39.12 JP1.6
  Bottom 0.61: v56.39,36.7 55.37,36.7 55.24,36.83 38.1,36.83 34.92,40.01 JP1.6
N$66  (via drill 0.8)
  Top 0.406: 44.83,47.5 45.17,47.5 U$8.1
  Top 0.61: 44.83,47.5 43.18,47.5 42.67,46.99 v42.67,45.72
  Bottom 0.61: JP1.7 32.38,45.09 33.02,45.72 v42.67,45.72
N$67  (via drill 0.8)
  Top 0.61: U5.3 61.13,40.81 v60.96,40.64 | ROBOARM.6 15.24,40.64 15.88,40.01 19.68,40.01 20.32,40.64 29.21,40.64 29.84,41.27 JP1.10
  Bottom 0.61: v60.96,40.64 62.87,40.64 63.5,40.01 63.5,34.29 62.74,33.53 38.23,33.53 35.05,36.7 31.11,36.7 29.84,37.97 JP1.10
N$68  (via drill 0.8)
  Top 0.406: U$9.1 45.34,43.69 45.09,43.94
  Top 0.61: 45.09,43.94 42.55,43.94 41.4,45.09 41.4,47.12 v40.13,48.39
  Bottom 0.61: 27.3,44.7 JP1.11 27.3,45.09 27.94,45.72 28.45,45.72 31.11,48.39 v40.13,48.39
RESET
  Top 0.406: U$2.3 12.7,24.77 13.97,23.5 13.97,14.61 14.61,13.97 IC6.3
SET
  Top 0.406: IC5.3 24.77,29.21 24.13,29.84 20.95,29.84 18.41,32.38 U$1.3

### Text on the board
Bottom: CATROBAT | RIEDER